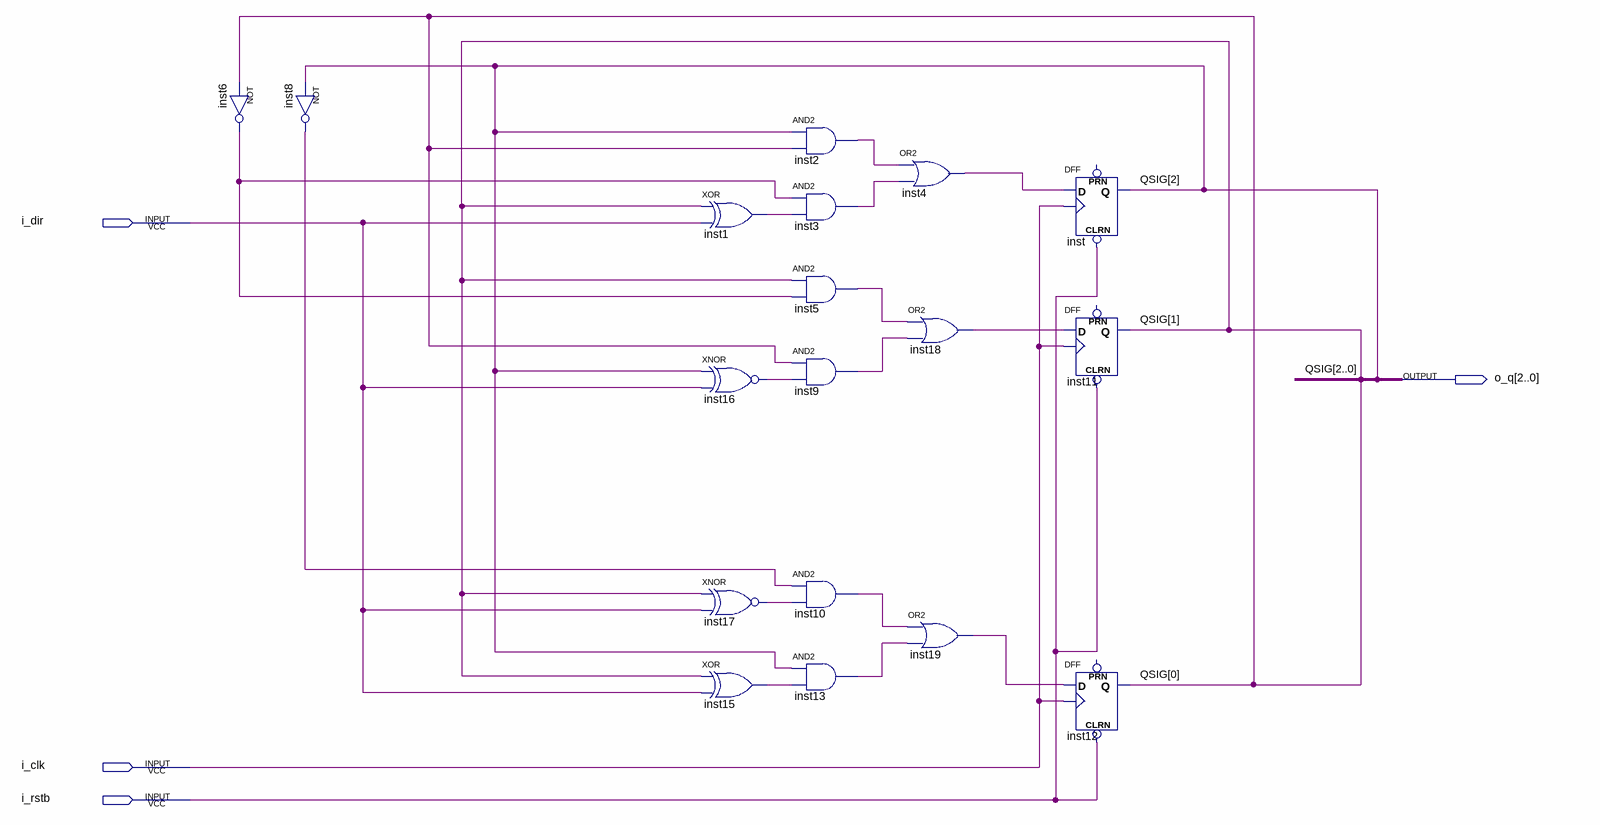
[diagram p0: schematic sheet]
// Quartus schematic counter_gray_3bit.bdf as structural Verilog: 18 symbols, 4 pins
module counter_gray_3bit (
  input  i_dir,
  input  i_clk,
  input  i_rstb,
  output [2:0] o_q
);

  wire inst1_out, inst2_out, inst3_out, inst4_out, inst5_out, inst6_out, inst8_out, inst9_out, inst10_out,
       inst13_out, inst15_out, inst16_out, inst17_out, inst18_out, inst19_out;

  not inst6 (inst6_out, o_q[0]);
  not inst8 (inst8_out, o_q[2]);
  xor inst1 (inst1_out, o_q[1], i_dir);
  xnor inst16 (inst16_out, o_q[2], i_dir);
  xnor inst17 (inst17_out, o_q[1], i_dir);
  xor inst15 (inst15_out, o_q[1], i_dir);
  and inst2 (inst2_out, o_q[2], o_q[0]);
  and inst3 (inst3_out, inst6_out, inst1_out);
  and inst5 (inst5_out, o_q[1], inst6_out);
  and inst9 (inst9_out, o_q[0], inst16_out);
  and inst10 (inst10_out, inst8_out, inst17_out);
  and inst13 (inst13_out, o_q[2], inst15_out);
  or inst4 (inst4_out, inst2_out, inst3_out);
  or inst18 (inst18_out, inst5_out, inst9_out);
  or inst19 (inst19_out, inst10_out, inst13_out);
  DFF inst (.CLRN(i_rstb), .CLK(i_clk), .D(inst4_out), .Q(o_q[2]));  // open: PRN
  DFF inst11 (.CLRN(i_rstb), .CLK(i_clk), .D(inst18_out), .Q(o_q[1]));  // open: PRN
  DFF inst12 (.CLRN(i_rstb), .CLK(i_clk), .D(inst19_out), .Q(o_q[0]));  // open: PRN

  // Other names for the same wires on the sheet: QSIG[2:0] = o_q
endmodule
